# Altium schematic sheet Mainboard.SchDoc
size A4; SheetNumber: 1; SheetTotal: 3
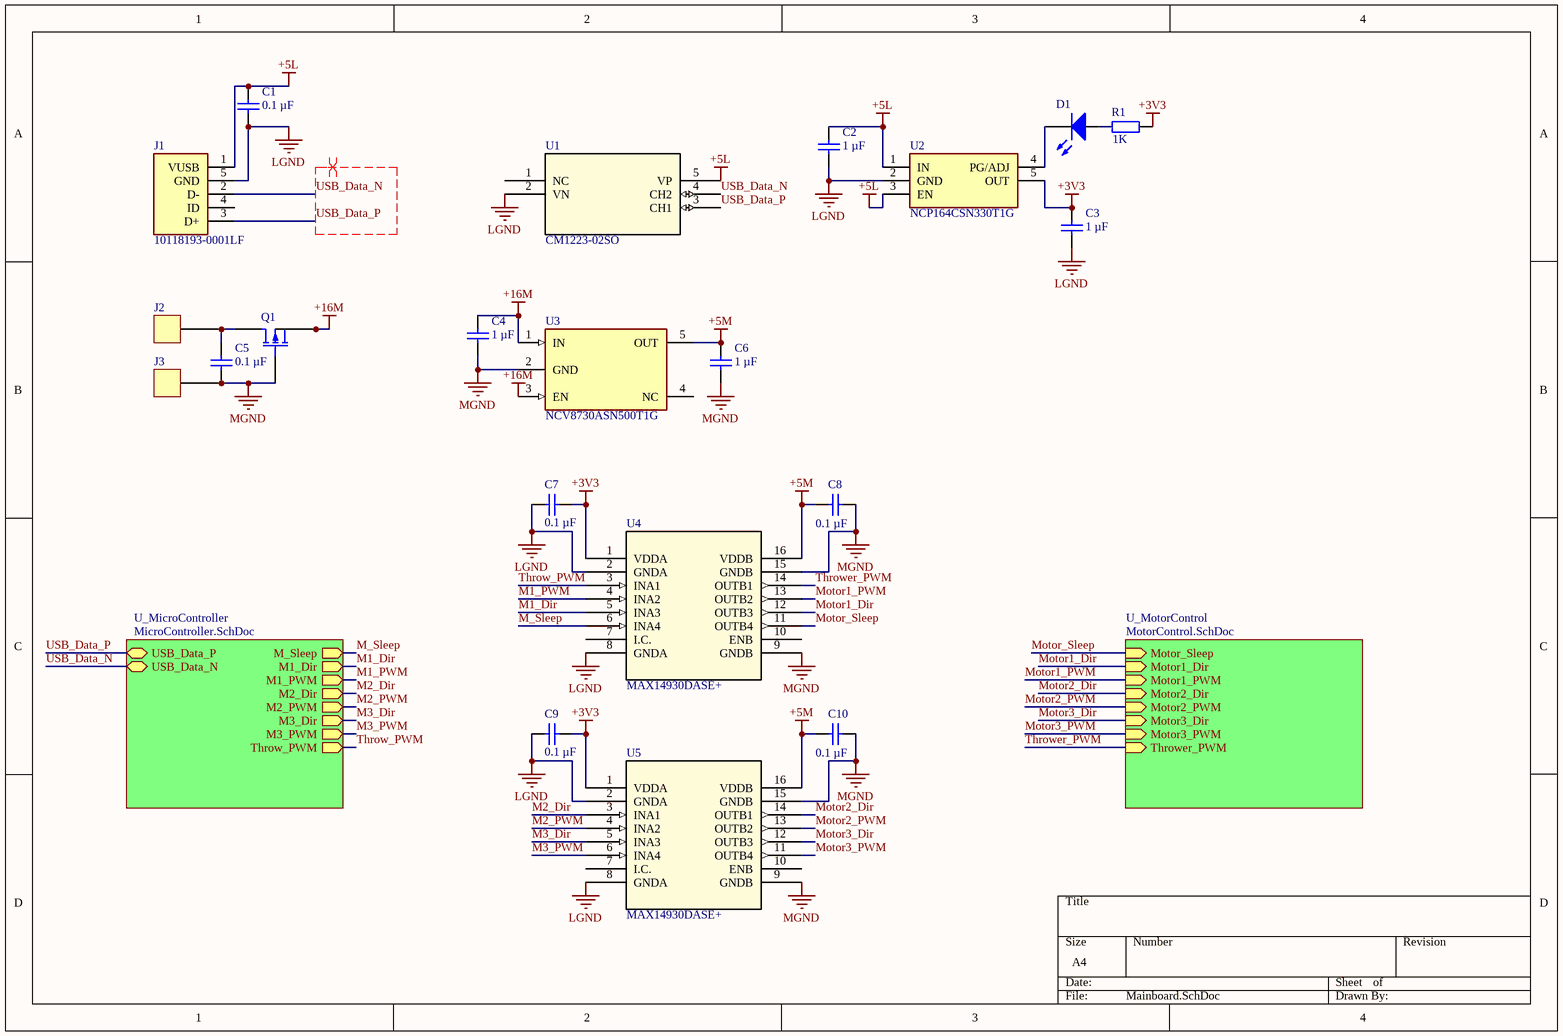
[diagram p0: Mainboard.SchDoc]

## Parts
C1  value 0.1 µF  [CAP_0603]  (hidden comment: MLCC)
C2  value 1 µF  [CAP_0603]  (hidden comment: MLCC)
C3  value 1 µF  [CAP_0603]  (hidden comment: MLCC)
C4  value 1 µF  [CAP_0603]  (hidden comment: MLCC)
C5  value 0.1 µF  [CAP_0603]  (hidden comment: MLCC)
C6  value 1 µF  [CAP_0603]  (hidden comment: MLCC)
C7  value 0.1 µF  [CAP_0603]  (hidden comment: MLCC)
C8  value 0.1 µF  [CAP_0603]  (hidden comment: MLCC)
C9  value 0.1 µF  [CAP_0603]  (hidden comment: MLCC)
C10  value 0.1 µF  [CAP_0603]  (hidden comment: MLCC)
D1  LED  [0603_GREEN]  (value not drawn)
J1  10118193-0001LF  [FCI_10118193-0001LF]
J2  Generic Power Pad  [New footprint 1]  (value not drawn)
J3  Generic Power Pad  [New footprint 1]  (value not drawn)
Q1  BUK6Y10-30P  [NXP-SOT669_N]  (value not drawn)
R1  value 1K  [RC0603N]  (hidden comment: RES)
U1  CM1223-02SO  [SOT23-5_3X1P7_ONS]
U2  NCP164CSN330T1G  [SOT95P275X110-5N]
U3  NCV8730ASN500T1G  [FP-483-MFG]
U4  MAX14930DASE+  [21-0041_S16+1_MXM]
U5  MAX14930DASE+  [21-0041_S16+1_MXM]

## Sub-sheets
U_MicroController = MicroController.SchDoc: M1_PWM (out), M_Sleep (out), M1_Dir (out), M2_Dir (out), M2_PWM (out), M3_Dir (out), M3_PWM (out), Throw_PWM (out), USB_Data_P (bidir), USB_Data_N (bidir)
U_MotorControl = MotorControl.SchDoc: Motor_Sleep (in), Motor1_Dir (in), Motor1_PWM (in), Motor2_Dir (in), Motor2_PWM (in), Motor3_Dir (in), Motor3_PWM (in), Thrower_PWM (in)

## Nets
+3V3: C3.2 C7.1 C9.1 R1.2 U2.5(OUT) U4.1(VDDA) U5.1(VDDA)
+5L: C1.2 C2.2 J1.1(VUSB) U1.5(VP) U2.1(IN) U2.3(EN)
+5M: C6.2 C8.2 C10.2 U3.5(OUT) U4.16(VDDB) U5.16(VDDB)
+16M: C4.2 Q1.1(S) Q1.2(S) Q1.3(S) U3.1(IN) U3.3(EN)
LGND: C1.1 C2.1 C3.1 C7.2 C9.2 J1.5(GND) U1.2(VN) U2.2(GND) U4.2(GNDA) U4.8(GNDA) U5.2(GNDA) U5.8(GNDA)
MGND: C4.1 C5.1 C6.1 C8.1 C10.1 J3.1 Q1.4(G) U3.2(GND) U4.9(GNDB) U4.15(GNDB) U5.9(GNDB) U5.15(GNDB)
M1_Dir: U4.5(INA3) ; sheet U_MicroController/M1_Dir
M1_PWM: U4.4(INA2) ; sheet U_MicroController/M1_PWM
M2_Dir: U5.3(INA1) ; sheet U_MicroController/M2_Dir
M2_PWM: U5.4(INA2) ; sheet U_MicroController/M2_PWM
M3_Dir: U5.5(INA3) ; sheet U_MicroController/M3_Dir
M3_PWM: U5.6(INA4) ; sheet U_MicroController/M3_PWM
M_Sleep: U4.6(INA4) ; sheet U_MicroController/M_Sleep
Motor1_Dir: U4.12(OUTB3) ; sheet U_MotorControl/Motor1_Dir
Motor1_PWM: U4.13(OUTB2) ; sheet U_MotorControl/Motor1_PWM
Motor2_Dir: U5.14(OUTB1) ; sheet U_MotorControl/Motor2_Dir
Motor2_PWM: U5.13(OUTB2) ; sheet U_MotorControl/Motor2_PWM
Motor3_Dir: U5.12(OUTB3) ; sheet U_MotorControl/Motor3_Dir
Motor3_PWM: U5.11(OUTB4) ; sheet U_MotorControl/Motor3_PWM
Motor_Sleep: U4.11(OUTB4) ; sheet U_MotorControl/Motor_Sleep
Throw_PWM: U4.3(INA1) ; sheet U_MicroController/Throw_PWM
Thrower_PWM: U4.14(OUTB1) ; sheet U_MotorControl/Thrower_PWM
USB_Data_N: J1.2(D-) U1.4(CH2) ; sheet U_MicroController/USB_Data_N
USB_Data_P: J1.3(D+) U1.3(CH1) ; sheet U_MicroController/USB_Data_P
NetC5_2: C5.2 J2.1 Q1.5(D)
NetD1_1: D1.1(A) R1.1
NetD1_2: D1.2(K) U2.4(PG/ADJ)

Not connected (* = marked no-connect by the designer): J1 4(ID); U1 1(NC); U3 4(NC); U4 7(I.C.) 10(ENB); U5 7(I.C.) 10(ENB)

## Layout directives
differential pair; differential pair class USB: USB_Data_N, USB_Data_P

## Library data of the parts
C1-C10 = CMP-059-000002-1: Multilayer Ceramic Capacitors; Tolerance: 10%; VoltageRatingDC: 5V; Component Type: Standard; Design Item ID: MLCC; Pin Count: 2; Source: Capacitors.SchLib
D1 = CMP-063-000000-1: LED Emitters; ForwardVoltage: 2V; Design Item ID: LED; Source: Leds.SchLib; Pin Count: 2; Component Type: Standard
J1 = CMP-002-000000-4: USB - micro B USB 2.0 Receptacle Connector 5 Position Surface Mount, Right Angle; Through Hole; MF: Amphenol ICC; Design Item ID: 10118193-0001LF; Package: None; SnapEDA_Link: https://www.snapeda.com/parts/10118193-0001LF/Amphenol%20FCI/view-part/2758989/?ref=snap; Value: *; MP: 10118193-0001LF; Availability: Unavailable; Pin Count: 11; Price: None; Source: SnapEDAsch.SchLib; Component Type: Standard
J2 J3 = CMP-00002-4
Q1 = CMP-011-000000-5: P-Channel Standard Level MOSFET SOT669-5; PartNumber: BUK7Y4R4-40EX; Channel Type: N; VDS [max] (V): 40; ID [max] (A): 100; Packing: Tape & Reel; Qr [typ] (nC): 18; IDM [max] (A): 521; VGSth [typ] (V): 3; Automotive Qualified: Y; PackageReference: SOT669; Pin Count: 5; PackageVersion: 13-02-27, 02/2013; Mounting Technology: Surface Mount; PackageDescription: 4-Pin Plastic Single-ended Surface Mounted Package, Body 4.9 x 3.95 mm, Pitch 1.27 mm; Component Type: Transistor; Code_JEDEC: MO-235; Design Item ID: CMP-1259-00420-1; Source: Components - 16.10.22 - 00.34.SchLib
R1 = CMP-061-000001-5: Chip Resistors; PowerRating: 0.25W; Component Type: Standard; Source: Resistors.SchLib; Pin Count: 2; Design Item ID: RES
U1 = CMP-044-000002-2: No Description Available; Mfr_Name: onsemi; RefDes: RefDes; Pin Count: 5; Copyright: Copyright (C) 2022 Ultra Librarian. All rights reserved.; Design Item ID: CM1223-02SO; Source: CM1223-02SO.SchLib; Manufacturer_Part_Number: CM1223-02SO; Type: DEV; Component Type: Standard
U2 = NCP164CSN330T1G: Integrated Circuit; Manufacturer_Name: onsemi; Datasheet Link: https://componentsearchengine.com/Datasheets/2/NCP164CSN330T1G.pdf; Height: 1.1mm; Manufacturer_Part_Number: NCP164CSN330T1G; Mouser Part Number: 863-NCP164CSN330T1G; Mouser Price/Stock: https://www.mouser.co.uk/ProductDetail/onsemi/NCP164CSN330T1G?qs=xZ%2FP%252Ba9zWqbi%2FAyy5UtoRw%3D%3D; Arrow Part Number: NCP164CSN330T1G; Arrow Price/Stock: https://www.arrow.com/en/products/ncp164csn330t1g/on-semiconductor?region=nac
U3 = NCV8730ASN500T1G: LDO Regulator TSOP-5
U4 U5 = MAX14930DASE+: No Description Available; Mfr_Name: Maxim Integrated Products; Copyright: Copyright (C) 2022 Ultra Librarian. All rights reserved.; Manufacturer_Part_Number: MAX14930DASE+; RefDes: RefDes; Type: DEV